# EasyEDA schematic SCH_HACK-HOLIDAY_2025-01-30.json
TITLE: Sheet_1; REV: 1.0; Date: 2024-12-20; Sheet: 1/1; Drawn By: JAISINH GHORPADE; Company: Your Company
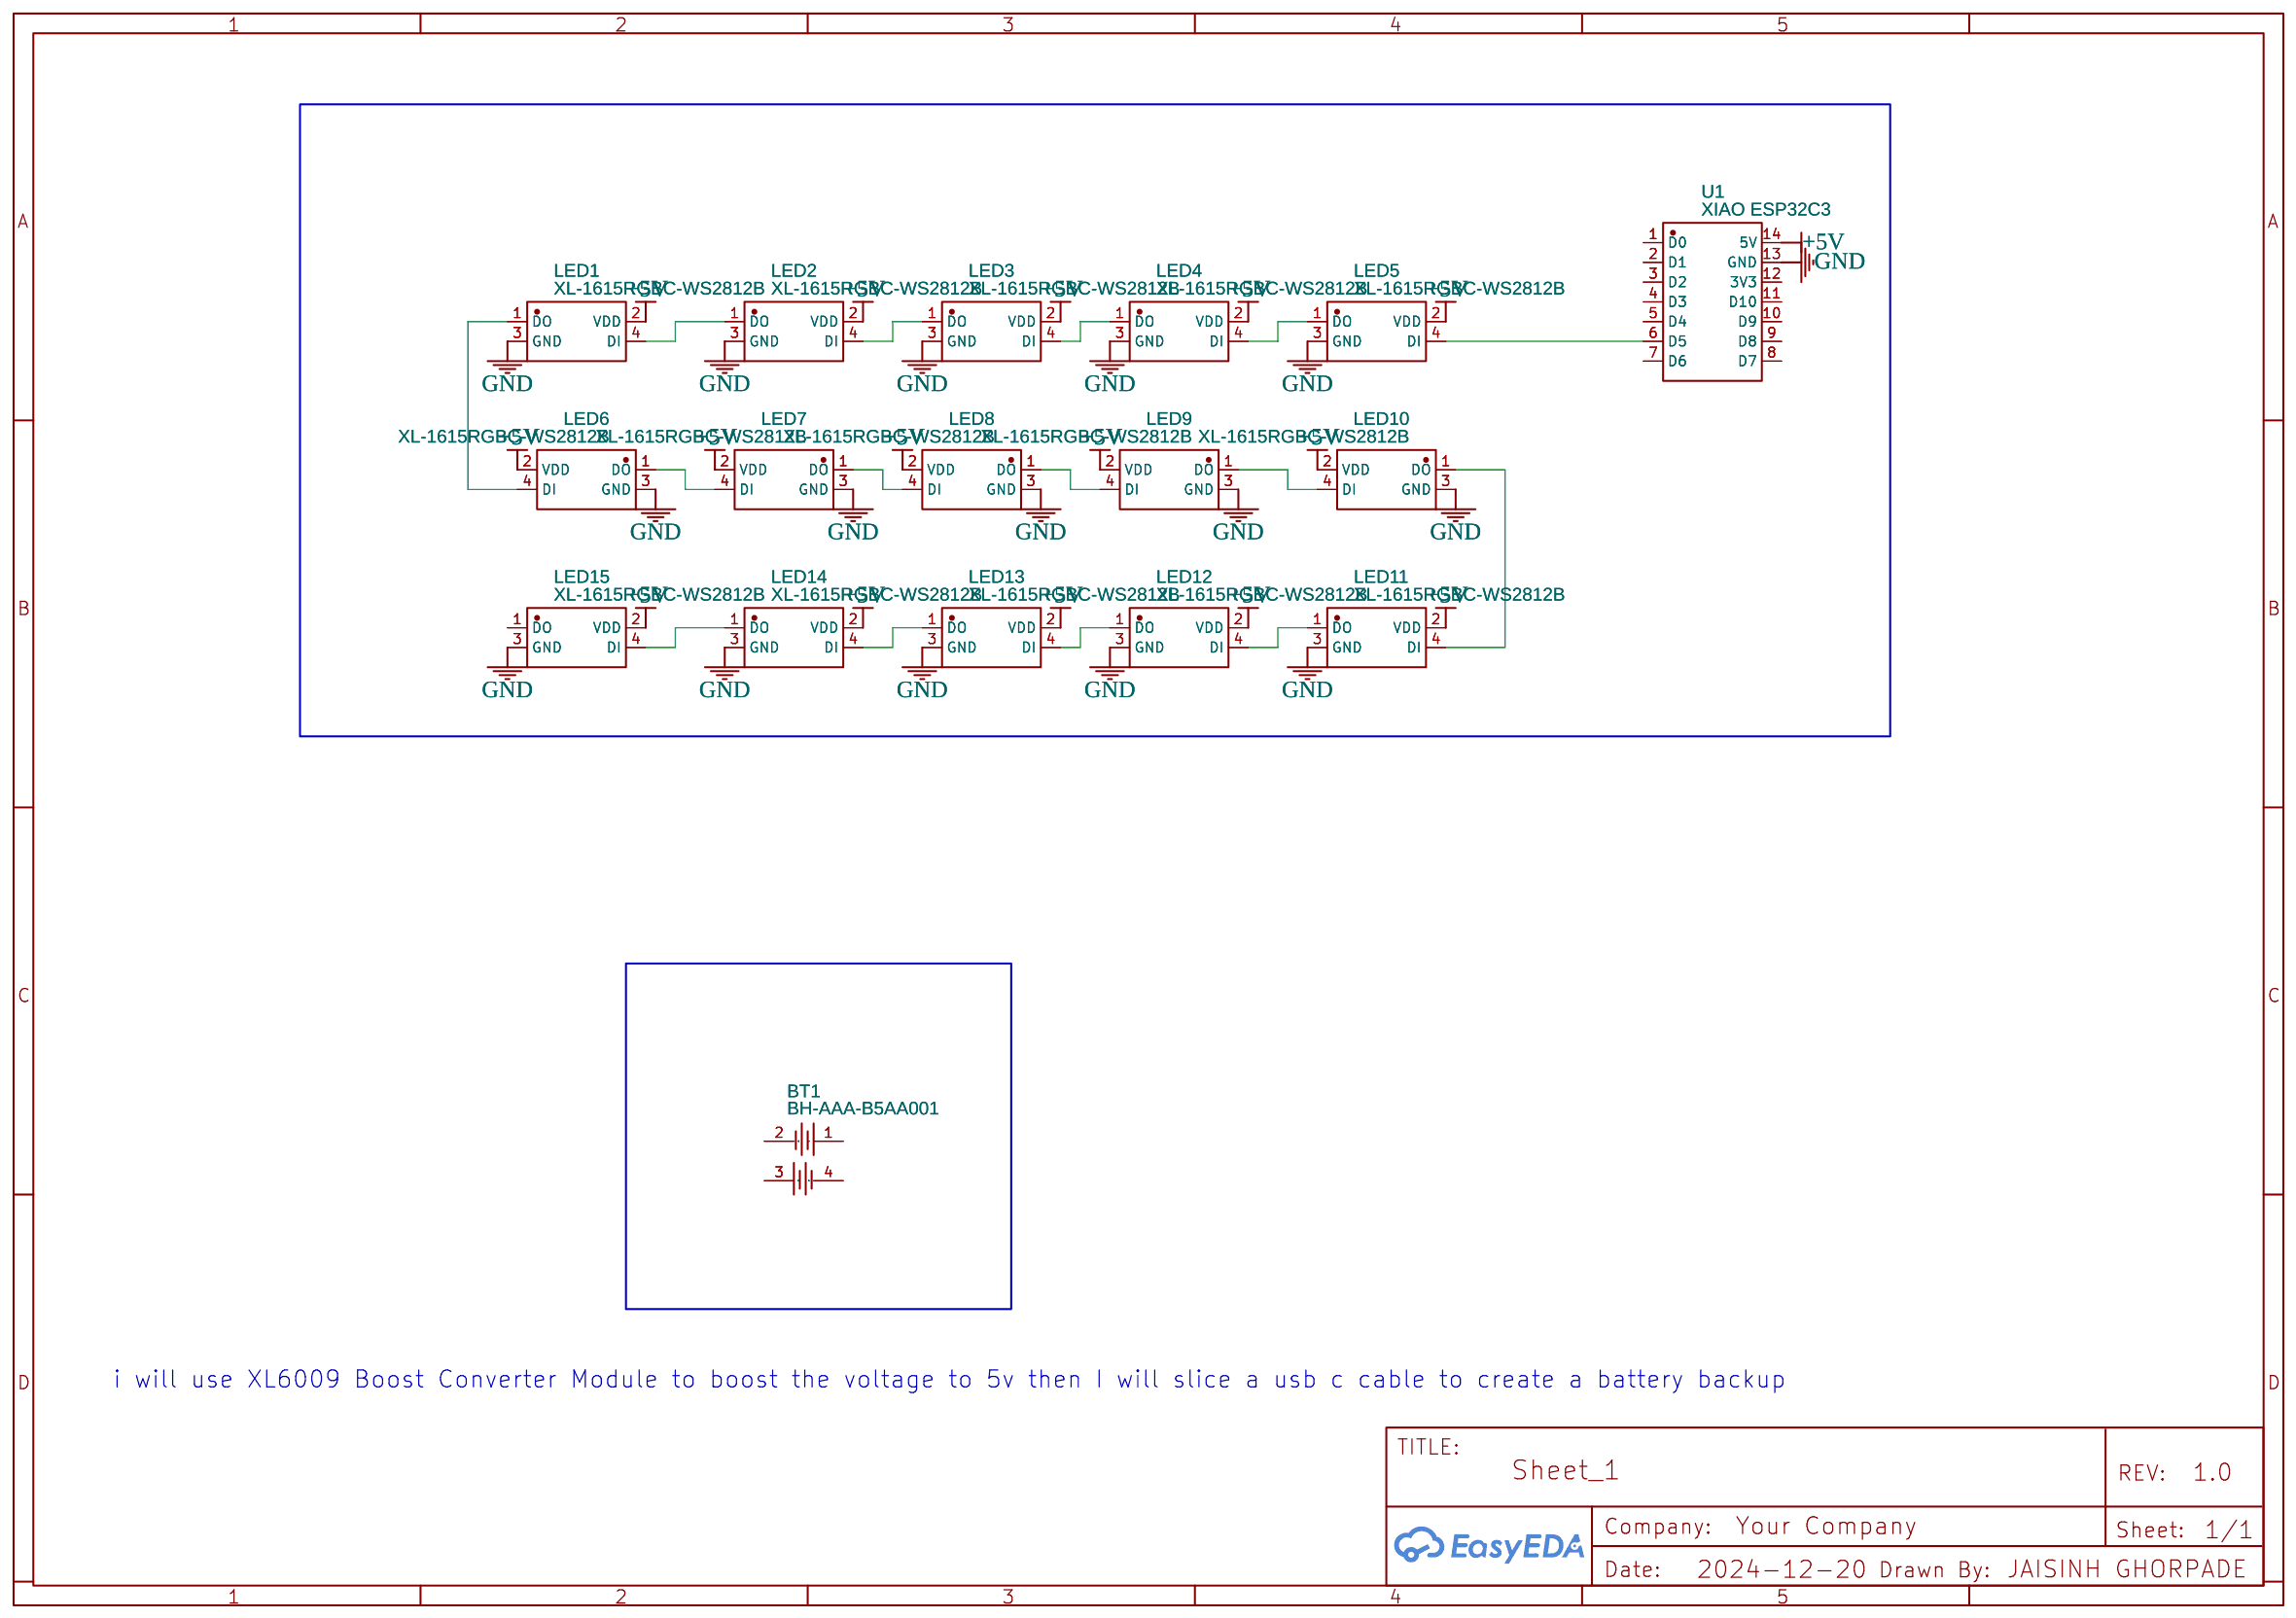
[diagram p0: schematic sheet]

## Parts
BT1  BH-AAA-B5AA001  [BAT-SMD_BH-AAA-B5AA001]
LED1  XL-1615RGBC-WS2812B  [LED-SMD_4P-L1.6-W1.5_XL-1615RGBC-WS2812B]
LED2  XL-1615RGBC-WS2812B  [LED-SMD_4P-L1.6-W1.5_XL-1615RGBC-WS2812B]
LED3  XL-1615RGBC-WS2812B  [LED-SMD_4P-L1.6-W1.5_XL-1615RGBC-WS2812B]
LED4  XL-1615RGBC-WS2812B  [LED-SMD_4P-L1.6-W1.5_XL-1615RGBC-WS2812B]
LED5  XL-1615RGBC-WS2812B  [LED-SMD_4P-L1.6-W1.5_XL-1615RGBC-WS2812B]
LED6  XL-1615RGBC-WS2812B  [LED-SMD_4P-L1.6-W1.5_XL-1615RGBC-WS2812B]
LED7  XL-1615RGBC-WS2812B  [LED-SMD_4P-L1.6-W1.5_XL-1615RGBC-WS2812B]
LED8  XL-1615RGBC-WS2812B  [LED-SMD_4P-L1.6-W1.5_XL-1615RGBC-WS2812B]
LED9  XL-1615RGBC-WS2812B  [LED-SMD_4P-L1.6-W1.5_XL-1615RGBC-WS2812B]
LED10  XL-1615RGBC-WS2812B  [LED-SMD_4P-L1.6-W1.5_XL-1615RGBC-WS2812B]
LED11  XL-1615RGBC-WS2812B  [LED-SMD_4P-L1.6-W1.5_XL-1615RGBC-WS2812B]
LED12  XL-1615RGBC-WS2812B  [LED-SMD_4P-L1.6-W1.5_XL-1615RGBC-WS2812B]
LED13  XL-1615RGBC-WS2812B  [LED-SMD_4P-L1.6-W1.5_XL-1615RGBC-WS2812B]
LED14  XL-1615RGBC-WS2812B  [LED-SMD_4P-L1.6-W1.5_XL-1615RGBC-WS2812B]
LED15  XL-1615RGBC-WS2812B  [LED-SMD_4P-L1.6-W1.5_XL-1615RGBC-WS2812B]
U1  XIAO ESP32C3  [COMM-SMD_KQ-2801_V106]

## Library data of the parts
BT1 = BH-AAA-B5AA001: Contributor: LCSC; Supplier: LCSC; Supplier Part: C964881; Manufacturer: MYOUNG(美阳); JLCPCB Part Class: Extended Part
LED1-LED15 = XL-1615RGBC-WS2812B: Contributor: lcsc; Supplier: LCSC; Supplier Part: C5349954; Manufacturer: XINGLIGHT(成兴光); JLCPCB Part Class: Extended Part
U1 = XIAO ESP32C3: Supplier: LCSC; Supplier Part: C19189385; Manufacturer: null; JLCPCB Part Class: Extended Part; Contributor: lcsc

## Nets
+5V: LED1.2(VDD) LED2.2(VDD) LED3.2(VDD) LED4.2(VDD) LED5.2(VDD) LED6.2(VDD) LED7.2(VDD) LED8.2(VDD) LED9.2(VDD) LED10.2(VDD) LED11.2(VDD) LED12.2(VDD) LED13.2(VDD) LED14.2(VDD) LED15.2(VDD) U1.14(5V)
GND: LED1.3(GND) LED2.3(GND) LED3.3(GND) LED4.3(GND) LED5.3(GND) LED6.3(GND) LED7.3(GND) LED8.3(GND) LED9.3(GND) LED10.3(GND) LED11.3(GND) LED12.3(GND) LED13.3(GND) LED14.3(GND) LED15.3(GND) U1.13(GND)
Net-(LED1-1): LED1.1(DO) LED6.4(DI)
Net-(LED1-4): LED1.4(DI) LED2.1(DO)
Net-(LED2-4): LED2.4(DI) LED3.1(DO)
Net-(LED3-4): LED3.4(DI) LED4.1(DO)
Net-(LED4-4): LED4.4(DI) LED5.1(DO)
Net-(LED5-4): LED5.4(DI) U1.6(D5)
Net-(LED6-1): LED6.1(DO) LED7.4(DI)
Net-(LED7-1): LED7.1(DO) LED8.4(DI)
Net-(LED8-1): LED8.1(DO) LED9.4(DI)
Net-(LED9-1): LED9.1(DO) LED10.4(DI)
Net-(LED10-1): LED10.1(DO) LED11.4(DI)
Net-(LED11-1): LED11.1(DO) LED12.4(DI)
Net-(LED12-1): LED12.1(DO) LED13.4(DI)
Net-(LED13-1): LED13.1(DO) LED14.4(DI)
Net-(LED14-1): LED14.1(DO) LED15.4(DI)

Not connected (* = marked no-connect by the designer): BT1 1 2 3 4; LED15 1(DO); U1 1(D0) 2(D1) 3(D2) 4(D3) 5(D4) 7(D6) 8(D7) 9(D8) 10(D9) 11(D10) 12(3V3)

## Notes on the sheet
- i will use XL6009 Boost Converter Module to boost the voltage to 5v then I will slice a usb c cable to create a battery backup
